# EAGLE design pifan (EAGLE 9.6.2)
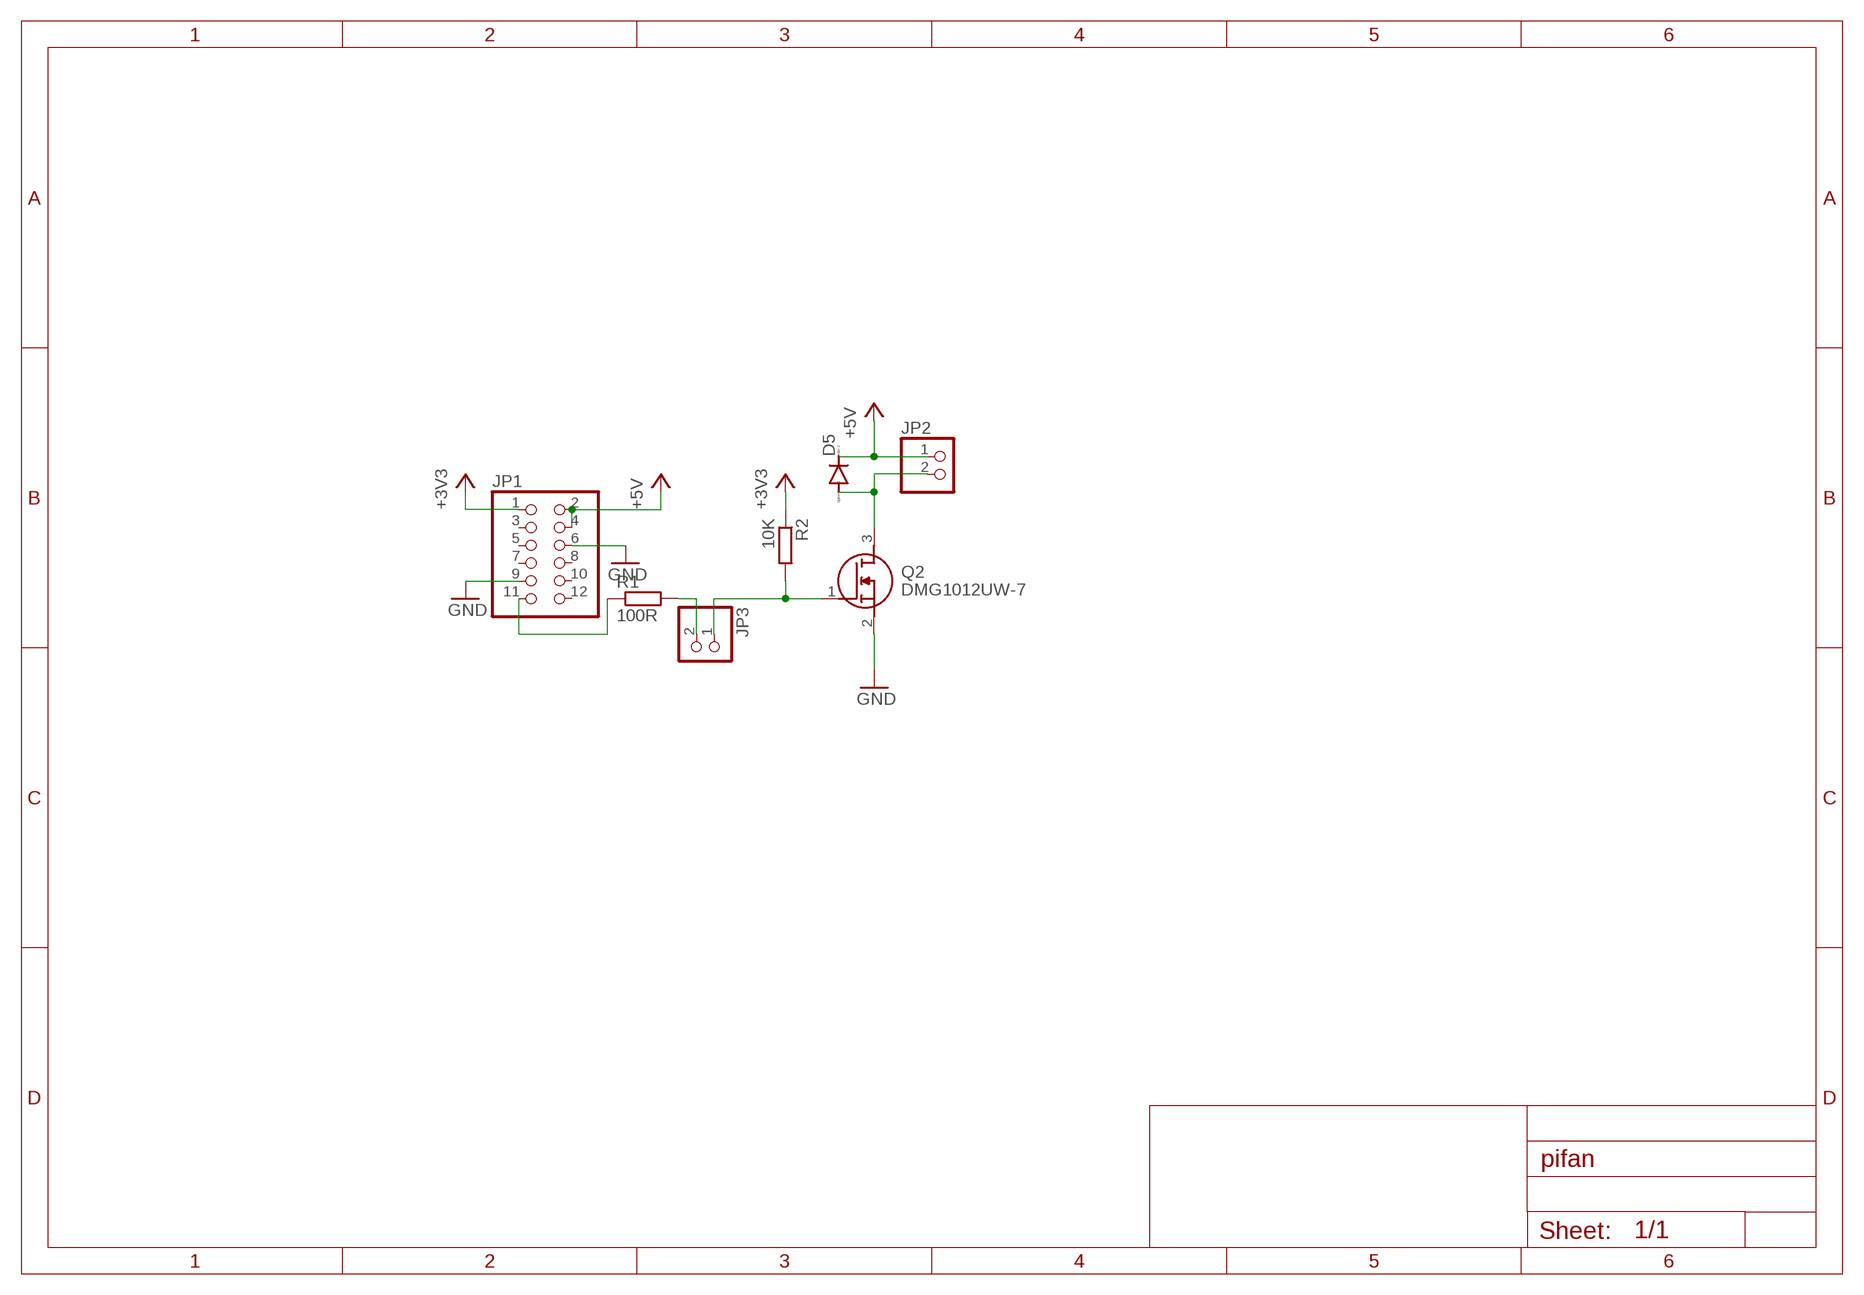
[diagram p0: schematic, sheet 1]

## Parts
D5  DIODE-SOD123  [SOD123]
JP1  PINHD-2X6  [2X06]
JP2  PINHD-1X2  [1X02]
JP3  PINHD-1X21X02SQUARE  [1X02SQUARE]
Q2  DMG1012UW-7  [SOT65P210X100-3N]
R1  100R  R-EU_R0805  [R0805]
R2  10K  R-EU_R0805  [R0805]

## Nets
+3V3: JP1.1 R2.1
+5V: D5.C JP1.2 JP1.4 JP2.1
GND: JP1.6 JP1.9 Q2.2(S)
N$1: JP1.11 R1.1
N$2: JP3.2 R1.2
N$3: D5.A JP2.2 Q2.3(D)
N$4: JP3.1 Q2.1(G) R2.2
Unconnected: JP1.3 JP1.5 JP1.7 JP1.8 JP1.10 JP1.12

## Library data of the parts
D5 = diode:DIODE-: DIODE
JP1 = pinhead:PINHD-2X6: PIN HEADER
JP2 JP3 = pinhead:PINHD-1X2: PIN HEADER
Q2 = SamacSys_Parts:DMG1012UW-7: MOSFET N-Channel 20V 1A SOT323 Diodes Inc DMG1012UW-7 N-channel MOSFET Transistor, 1 A, 20 V, 3-Pin SOT-323 Source: Datasheet <https://datasheet.datasheetarchive.com/originals/distributors/Datasheets-DGA23/1583163.pdf>; DESCRIPTION: MOSFET N-Channel 20V 1A SOT323 Diodes Inc DMG1012UW-7 N-channel MOSFET Transistor, 1 A, 20 V, 3-Pin SOT-323; HEIGHT: 1mm; MANUFACTURER_NAME: Diodes Inc.; MANUFACTURER_PART_NUMBER: DMG1012UW-7; MOUSER_PART_NUMBER: 621-DMG1012UW-7; MOUSER_PRICE-STOCK: https://www.mouser.co.uk/ProductDetail/Diodes-Incorporated/DMG1012UW-7?qs=vIZ3oKQCLxp8XxWFc0YBWg%3D%3D
R1 R2 = rcl:R-EU_: RESISTOR, European symbol; SPICEPREFIX: R

## Board
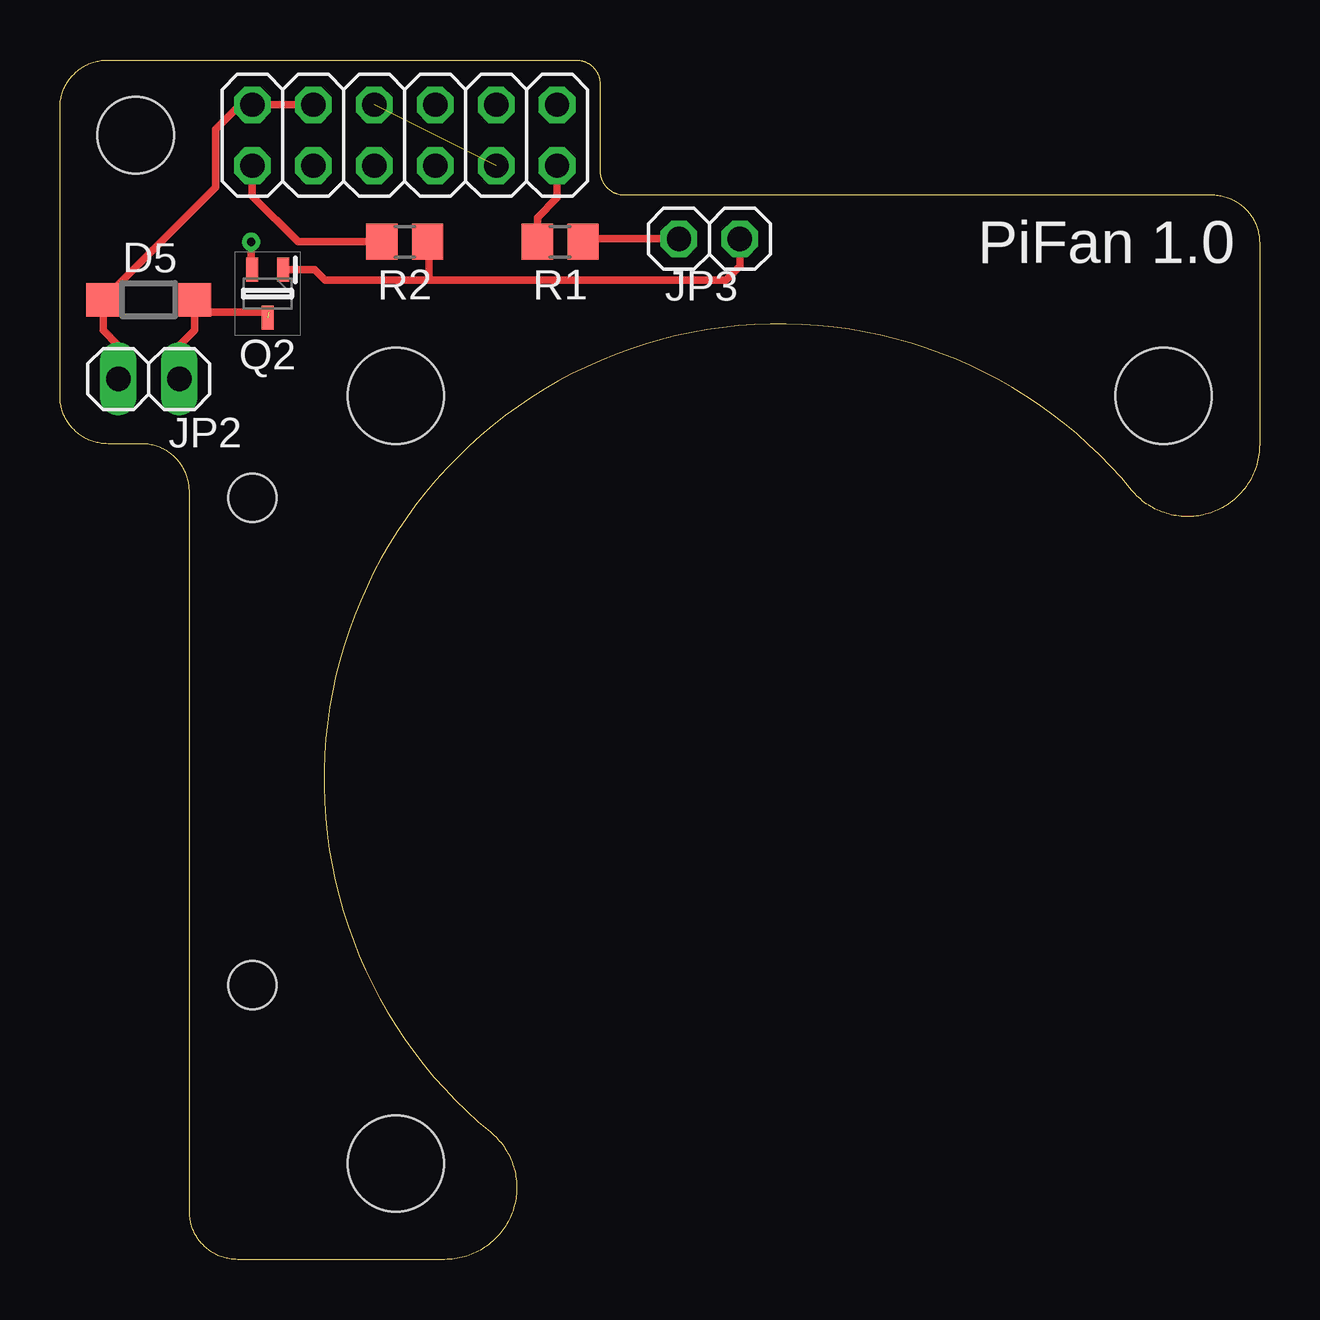
[diagram p1: board, top side]
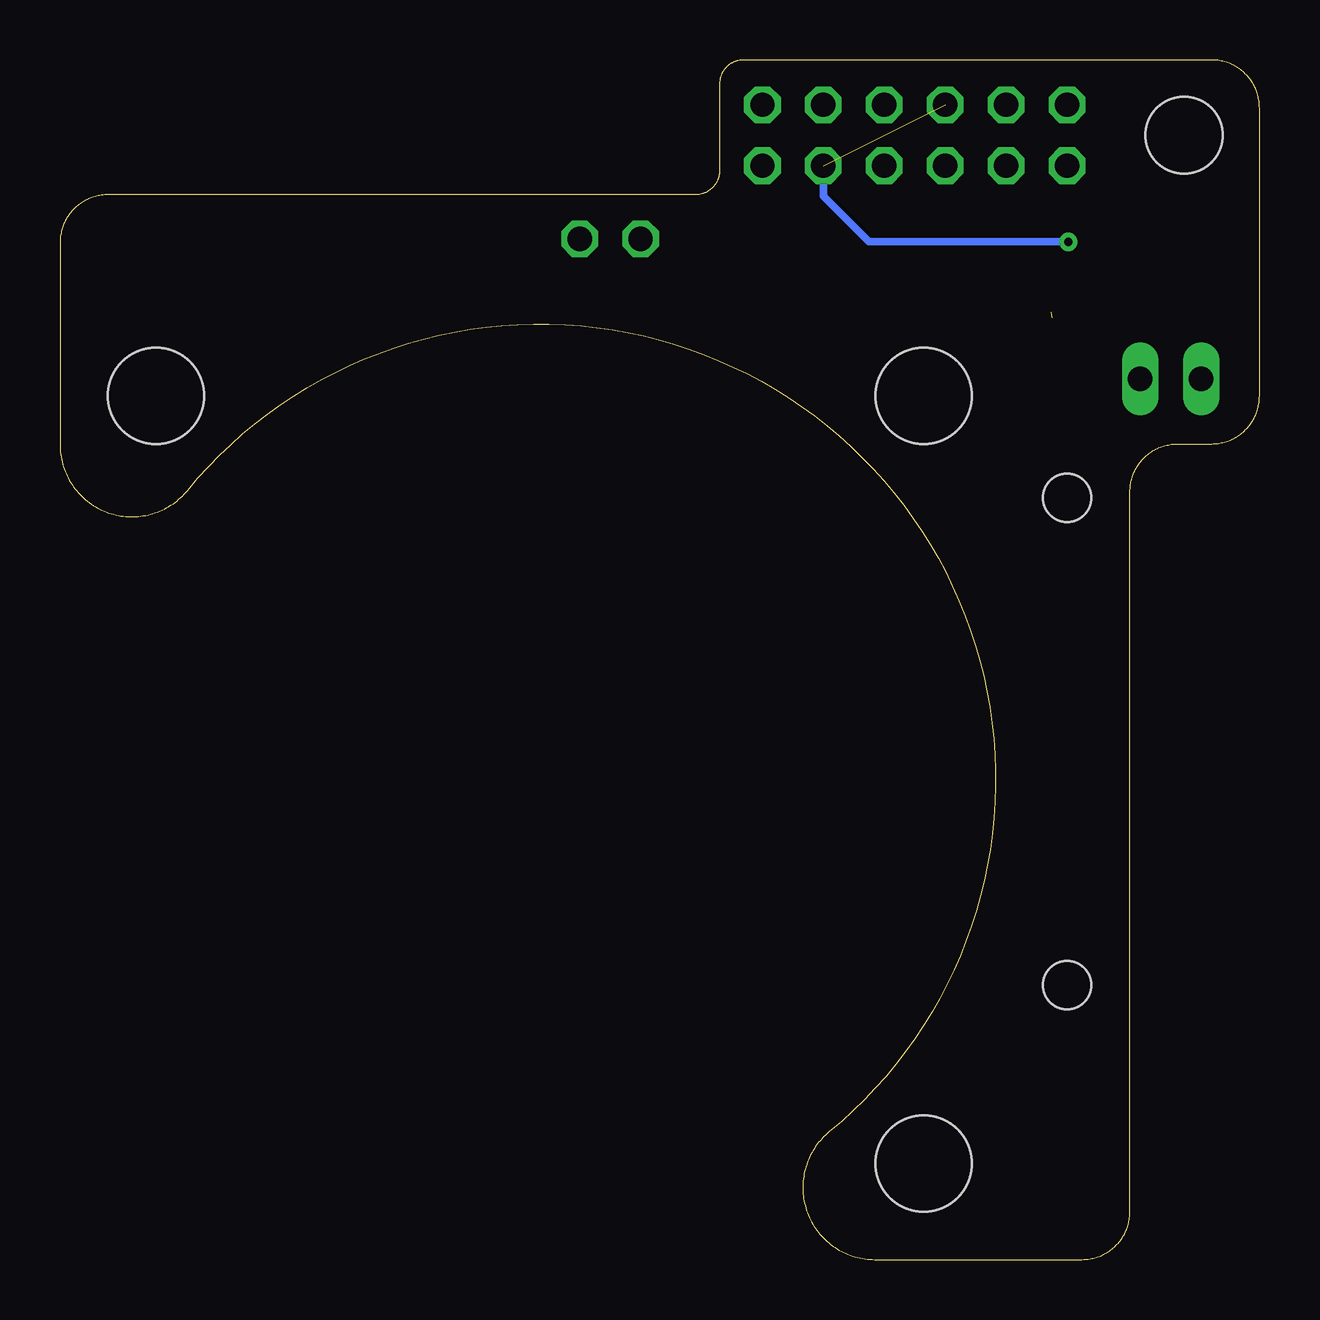
[diagram p2: board, bottom side, seen from below]

Size 50 x 50 mm. Coordinates in mm from the lower left corner, seen from the top.
Outline: 16.04,0 7.4,0 7.33,0 7.26,0.01 7.2,0.01 7.13,0.02 7.06,0.03 6.99,0.04 6.93,0.06 6.86,0.07 6.79,0.09 6.73,0.12 6.67,0.14 6.6,0.17 6.54,0.19 6.48,0.22 6.42,0.26 6.36,0.29 6.3,0.33 6.25,0.37 6.19,0.41 6.14,0.45 6.09,0.49 6.04,0.54 5.99,0.59 5.94,0.64 5.89,0.69 5.85,0.74 5.81,0.79 5.77,0.85 5.73,0.9 5.69,0.96 5.66,1.02 5.62,1.08 5.59,1.14 5.57,1.2 5.54,1.27 5.52,1.33 5.49,1.4 5.47,1.46 5.46,1.53 5.44,1.59 5.43,1.66 5.42,1.73 5.41,1.79 5.41,1.86 5.4,1.93 5.4,2 5.4,32 5.4,32.07 5.4,32.14 5.39,32.2 5.38,32.27 5.37,32.34 5.36,32.41 5.34,32.47 5.33,32.54 5.31,32.6 5.29,32.67 5.26,32.73 5.23,32.8 5.21,32.86 5.18,32.92 5.14,32.98 5.11,33.04 5.07,33.1 5.03,33.15 4.99,33.21 4.95,33.26 4.91,33.31 4.86,33.37 4.81,33.41 4.77,33.46 4.71,33.51 4.66,33.55 4.61,33.59 4.55,33.63 4.5,33.67 4.44,33.71 4.38,33.74 4.32,33.78 4.26,33.81 4.2,33.83 4.13,33.86 4.07,33.88 4,33.91 3.94,33.93 3.87,33.94 3.81,33.96 3.74,33.97 3.67,33.98 3.6,33.99 3.54,33.99 3.47,34 3.4,34 2,34 1.93,34 1.86,34.01 1.79,34.01 1.73,34.02 1.66,34.03 1.59,34.04 1.53,34.06 1.46,34.07 1.4,34.09 1.33,34.12 1.27,34.14 1.2,34.17 1.14,34.19 1.08,34.22 1.02,34.26 0.96,34.29 0.9,34.33 0.85,34.37 0.79,34.41 0.74,34.45 0.69,34.49 0.64,34.54 0.59,34.59 0.54,34.63 0.49,34.69 0.45,34.74 0.41,34.79 0.37,34.85 0.33,34.9 0.29,34.96 0.26,35.02 0.22,35.08 0.19,35.14 0.17,35.2 0.14,35.27 0.12,35.33 0.09,35.4 0.07,35.46 0.06,35.53 0.04,35.59 0.03,35.66 0.02,35.73 0.01,35.8 0.01,35.86 0,35.93 0,36 0,48 0,48.07 0.01,48.14 0.01,48.2 0.02,48.27 0.03,48.34 0.04,48.41 0.06,48.47 0.07,48.54 0.09,48.6 0.12,48.67 0.14,48.73 0.17,48.8 0.19,48.86 0.22,48.92 0.26,48.98 0.29,49.04 0.33,49.1 0.37,49.15 0.41,49.21 0.45,49.26 0.49,49.31 0.54,49.37 0.59,49.41 0.64,49.46 0.69,49.51 0.74,49.55 0.79,49.59 0.85,49.63 0.9,49.67 0.96,49.71 1.02,49.74 1.08,49.78 1.14,49.81 1.2,49.83 1.27,49.86 1.33,49.88 1.4,49.91 1.46,49.93 1.53,49.94 1.59,49.96 1.66,49.97 1.73,49.98 1.79,49.99 1.86,49.99 1.93,50 2,50 21.51,50 21.54,50 21.58,50 21.61,49.99 21.64,49.99 21.68,49.98 21.71,49.98 21.74,49.97 21.78,49.96 21.81,49.95 21.84,49.94 21.88,49.93 21.91,49.92 21.94,49.9 21.97,49.89 22,49.87 22.03,49.85 22.06,49.84 22.08,49.82 22.11,49.8 22.14,49.78 22.16,49.75 22.19,49.73 22.21,49.71 22.24,49.68 22.26,49.66 22.28,49.63 22.3,49.6 22.32,49.58 22.34,49.55 22.36,49.52 22.38,49.49 22.4,49.46 22.41,49.43 22.42,49.4 22.44,49.37 22.45,49.34 22.46,49.3 22.47,49.27 22.48,49.24 22.49,49.2 22.49,49.17 22.5,49.14 22.5,49.1 22.51,49.07 22.51,49.03 22.51,49 22.51,45.38 22.51,45.35 22.51,45.31 22.51,45.28 22.52,45.24 22.52,45.21 22.53,45.18 22.54,45.14 22.54,45.11 22.55,45.08 22.57,45.05 22.58,45.01 22.59,44.98 22.6,44.95 22.62,44.92 22.64,44.89 22.65,44.86 22.67,44.83 22.69,44.8 22.71,44.78 22.73,44.75 22.75,44.72 22.78,44.7 22.8,44.67 22.82,44.65 22.85,44.63 22.88,44.6 22.9,44.58 22.93,44.56 22.96,44.55 22.99,44.53 23.02,44.51 23.05,44.49 23.08,44.48 23.11,44.46 23.14,44.45 23.17,44.44 23.2,44.43 23.24,44.42 23.27,44.41 23.3,44.4 23.34,44.4 23.37,44.39 23.41,44.39 23.44,44.38 23.47,44.38 23.51,44.38 48,44.38 48.07,44.38 48.14,44.38 48.2,44.37 48.27,44.36 48.34,44.35 48.41,44.34 48.47,44.32 48.54,44.31 48.6,44.29 48.67,44.27 48.73,44.24 48.8,44.22 48.86,44.19 48.92,44.16 48.98,44.12 49.04,44.09 49.1,44.05 49.15,44.02 49.21,43.98 49.26,43.93 49.31,43.89 49.37,43.84 49.41,43.8 49.46,43.75 49.51,43.7 49.55,43.64 49.59,43.59 49.63,43.53 49.67,43.48 49.71,43.42 49.74,43.36 49.78,43.3 49.81,43.24 49.83,43.18 49.86,43.12 49.88,43.05 49.91,42.99 49.93,42.92 49.94,42.85 49.96,42.79 49.97,42.72 49.98,42.65 49.99,42.59 49.99,42.52 50,42.45 50,42.38 50,33.96 50,33.86 49.99,33.76 49.98,33.65 49.97,33.55 49.95,33.45 49.94,33.35 49.91,33.24 49.89,33.15 49.86,33.05 49.82,32.95 49.79,32.85 49.75,32.76 49.7,32.66 49.66,32.57 49.61,32.48 49.55,32.39 49.5,32.3 49.44,32.22 49.38,32.13 49.31,32.05 49.24,31.97 49.17,31.9 49.1,31.82 49.03,31.75 48.95,31.68 48.87,31.62 48.79,31.55 48.7,31.49 48.62,31.44 48.53,31.38 48.44,31.33 48.34,31.28 48.25,31.24 48.16,31.2 48.06,31.16 47.96,31.12 47.86,31.09 47.76,31.06 47.66,31.04 47.56,31.02 47.46,31 47.36,30.99 47.25,30.98 47.15,30.97 47.05,30.96 46.94,30.96 46.84,30.97 46.74,30.98 46.63,30.99 46.53,31 46.43,31.02 46.33,31.04 46.23,31.07 46.13,31.09 46.03,31.13 45.93,31.16 45.83,31.2 45.74,31.24 45.65,31.29 45.55,31.34 45.46,31.39 45.38,31.44 45.29,31.5 45.21,31.56 45.12,31.62 45.04,31.69 44.97,31.76 44.89,31.83 44.82,31.9 44.75,31.98 44.68,32.06 44.25,32.56 43.81,33.05 43.35,33.52 42.87,33.98 42.38,34.42 41.87,34.84 41.34,35.24 40.81,35.63 40.26,35.99 39.7,36.34 39.12,36.67 38.54,36.97 37.94,37.26 37.34,37.53 36.72,37.77 36.1,37.99 35.47,38.2 34.84,38.37 34.2,38.53 33.55,38.67 32.9,38.78 32.24,38.87 31.59,38.93 30.93,38.98 30.27,39 29.61,39 28.95,38.97 28.29,38.92 27.63,38.85 26.98,38.76 26.33,38.64 25.68,38.5 25.04,38.34 24.41,38.16 23.78,37.95 23.16,37.73 22.55,37.48 21.95,37.21 21.35,36.92 20.77,36.61 20.2,36.28 19.64,35.93 19.09,35.56 18.56,35.17 18.04,34.76 17.53,34.34 17.04,33.89 16.56,33.44 16.11,32.96 15.66,32.47 15.24,31.96 14.83,31.44 14.44,30.91 14.07,30.36 13.72,29.8 13.39,29.23 13.08,28.65 12.79,28.05 12.52,27.45 12.27,26.84 12.05,26.22 11.84,25.59 11.66,24.96 11.5,24.32 11.36,23.67 11.24,23.02 11.15,22.37 11.08,21.71 11.03,21.05 11,20.39 11,19.73 11.02,19.07 11.07,18.41 11.13,17.76 11.22,17.1 11.33,16.45 11.47,15.8 11.63,15.16 11.8,14.53 12.01,13.9 12.23,13.28 12.47,12.66 12.74,12.06 13.03,11.46 13.33,10.88 13.66,10.3 14.01,9.74 14.37,9.19 14.76,8.66 15.16,8.13 15.58,7.62 16.02,7.13 16.48,6.65 16.95,6.19 17.44,5.75 17.94,5.32 18.02,5.25 18.1,5.18 18.17,5.11 18.24,5.03 18.31,4.96 18.38,4.88 18.44,4.79 18.5,4.71 18.56,4.62 18.61,4.54 18.66,4.45 18.71,4.35 18.76,4.26 18.8,4.17 18.84,4.07 18.87,3.97 18.91,3.87 18.93,3.77 18.96,3.67 18.98,3.57 19,3.47 19.01,3.37 19.02,3.26 19.03,3.16 19.04,3.06 19.04,2.95 19.03,2.85 19.02,2.75 19.01,2.64 19,2.54 18.98,2.44 18.96,2.34 18.94,2.24 18.91,2.14 18.88,2.04 18.84,1.94 18.8,1.84 18.76,1.75 18.72,1.66 18.67,1.56 18.62,1.47 18.56,1.39 18.51,1.3 18.45,1.21 18.38,1.13 18.32,1.05 18.25,0.97 18.18,0.9 18.1,0.83 18.03,0.76 17.95,0.69 17.87,0.62 17.78,0.56 17.7,0.5 17.61,0.45 17.52,0.39 17.43,0.34 17.34,0.3 17.24,0.25 17.15,0.21 17.05,0.18 16.95,0.14 16.85,0.11 16.75,0.09 16.65,0.06 16.55,0.04 16.45,0.03 16.35,0.02 16.24,0.01 16.14,0 16.04,0
Copper layers (1*16): Top 0.035mm / dielectric 1.5mm / Bottom 0.035mm
Design rules "default": minimum track width 6mil, minimum drill 0.35mm, track to track 6mil, track to pad 6mil, pad to pad 6mil, via to via 6mil, smd to smd 6mil, copper to edge 40mil, drill to drill 6mil, minimum pad ring 10mil, minimum via ring 8mil, stop-mask expansion 4mil, vias tented up to drill 0mil, thermal gap 10mil
Holes 3.2 mm at 3.15,46.86
Holes 4 mm at 14,36 14,4 46,36
Holes 2 mm at 8.02,11.43 8.02,31.75

### Footprints (pad centres in the part's own frame; a part is rotated, then mirrored left to right if it is on the bottom)
SOD123 = smd 1.4 x 1.4: A 1.9,0; C -1.9,0
2X06 = drill 1.016 octagon: 1 -6.35,-1.27; 2 -6.35,1.27; 3 -3.81,-1.27; 4 -3.81,1.27; 5 -1.27,-1.27; 6 -1.27,1.27; 7 1.27,-1.27; 8 1.27,1.27; 9 3.81,-1.27; 10 3.81,1.27; 11 6.35,-1.27; 12 6.35,1.27
1X02 = drill 1.016 long: 1 -1.27,0; 2 1.27,0
1X02SQUARE = drill 1.016 octagon: 1 -1.27,0; 2 1.27,0
SOT65P210X100-3N = smd 1 x 0.5: 1 -1,0.65; 2 -1,-0.65; 3 1,0
R0805 = smd 1.3 x 1.5: 1 -0.95,0; 2 0.95,0

### Placement (x,y rotation side)
D5  3.7,40.01 0 top
JP1  14.37,46.86 0 top
JP2  3.7,36.7 0 top
JP3  27.07,42.55 180 top
Q2  8.66,40.26 270 top
R1  20.85,42.42 0 top
R2  14.37,42.42 0 top

### Tracks (layer width: path | path; a pad name or v marks a point on that pad's centre or on a via)
+3V3
  Top 0.305: JP1.1 8.02,44.32 9.93,42.42 R2.1
+5V
  Top 0.305: JP1.4 JP1.2 7.51,48.13 6.5,47.12 6.5,44.7 D5.C 1.8,38.73 2.43,38.1 JP2.1
GND  (via drill 0.35)  (1 unrouted)
  Top 0.305: Q2.2 7.97,41.29 v7.97,42.42
  Bottom 0.305: JP1.9 18.18,44.32 16.27,42.42 v7.97,42.42
N$1
  Top 0.305: JP1.11 20.72,44.26 19.9,43.43 R1.1
N$2
  Top 0.305: R1.2 21.92,42.55 JP3.2
N$3  (1 unrouted)
  Top 0.152: D5.A
  Top 0.305: 8.71,39.5 6.11,39.5 D5.A | JP2.2 4.97,38.1 5.61,38.73 D5.A
N$4
  Top 0.305: Q2.1 10.62,41.26 11.05,40.83 15.39,40.83 | R2.2 15.39,42.35 15.39,40.83 | 15.39,40.83 27.77,40.83 28.34,41.4 JP3.1

### Text on the board
tNames: PiFan 1.0